# Altium project LVGAmp.PRJPCB
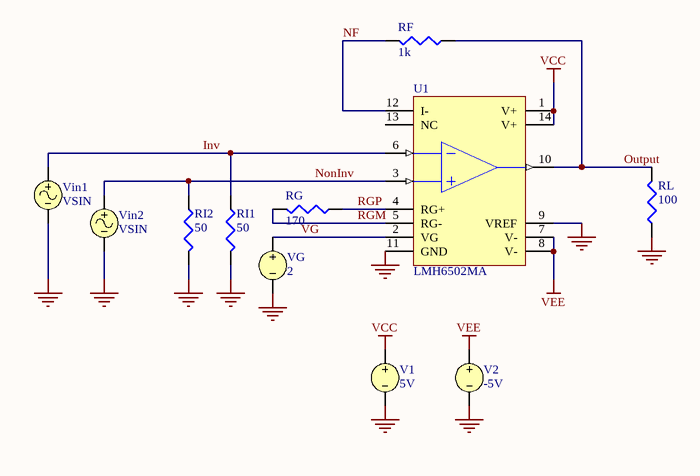
[diagram p0: LVGAmp.schdoc]
1 sheet, 11 parts. Net scope: global (net labels, ports and power ports of the same name join across sheets).

## Sheet LVGAmp.schdoc: Analog Amplifier
size A4; Organization: Altium Limited; Address1: L3, 12a Rodborough Rd; Address2: Frenchs Forest; Address3: NSW; Address4: Australia 2086; DocumentNumber: 1; SheetNumber: 1; SheetTotal: 1

### Parts
RF  value 1k  (hidden comment: 100k)
RG  value 170  (hidden comment: 10k)
RI1  value 50  (hidden comment: 10k)
RI2  value 50  (hidden comment: 10k)
RL  value 100  (hidden comment: 25k)
U1  LMH6502MA  [M14A_N]
V1  value 5V  (hidden comment: 12V)
V2  value -5V  (hidden comment: -12V)
VG  value 2  (hidden comment: 12V)
Vin1  VSIN
Vin2  VSIN

### Nets
GND: RI1.1(TOP) RI2.1(TOP) RL.2(BOT) U1.9(VREF) U1.11(GND) V1.2 V2.2 VG.2 Vin1.2 Vin2.2
VCC: U1.1(V+) U1.14(V+) V1.1
VEE: U1.7(V-) U1.8(V-) V2.1
Inv: RI1.2(BOT) U1.6(VIN-) Vin1.1
NF: RF.1(TOP) U1.12(I-)
NonInv: RI2.2(BOT) U1.3(VIN+) Vin2.1
Output: RF.2(BOT) RL.1(TOP) U1.10(VOUT)
RGM: RG.1(TOP) U1.5(RG-)
RGP: RG.2(BOT) U1.4(RG+)
VG: U1.2(VG) VG.1

Not connected (* = marked no-connect by the designer): U1 13(NC)

### Notes on the sheet
- Title
- Size:
- Date:
- A4
- Number:
- Time:
- Revision:
- Sheet
- of
- File:

### Library data of the parts
RF RG RI1 RI2 RL = RES: Resistor
U1 = LMH6502MA: Wideband, Low Power, Linear-in-dB Variable Gain Amplifier; Manufacturer: National Semiconductor; CompType: Amplifiers; PackageTopMarking: NSUZXYTT*LMH6502MA; Published: 4-Dec-2008; DatasheetVersion: Jun-2004; PackageVersion: revJ, Jan-1996; PackageReference: M14A; Publisher: Altium Limited; PackageDescription: Molded Package S.O., .150in Wide, 14 Lead; PartNumber: LMH6502MA; RoHS: O; PinCount: 14; DigiKeyPartNumber: LMH6502MA-ND; Code_JEDEC: MS-012AB; Code_IPC: SOIC127P600-14; ComponentLink1Description: LMH6502 Datasheet; ComponentLink1URL: http://www.national.com/ds/LM/LMH6502.pdf; ComponentLink2Description: LMH6502 Web Page; ComponentLink2URL: http://www.national.com/pf/LM/LMH6502.html; ComponentLink3Description: M14A Package Page; ComponentLink3URL: http://www.national.com/packaging/folders/m14a.html; DeviceFunction: Amplifier
V1 V2 VG = VSRC: Voltage Source
Vin1 Vin2 = VSIN: Sinusoidal Voltage Source